# EAGLE schematic ntpi_adapter_v1_led (EAGLE 6.4)
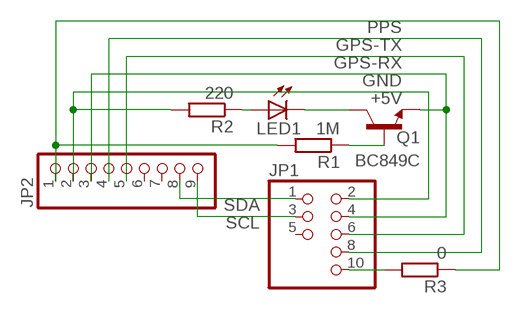
[diagram p0: schematic, sheet 1]

## Parts
JP1  PINHEAD-NTPI  [PINHEAD-NTPI]
JP2  PINHD-1X9  [1X09]
LED1  LEDCHIPLED_0805  [CHIPLED_0805]
Q1  BC849C  BC848ASMD  [SOT23]
R1  1M  R-EU_R0805W  [R0805W]
R2  220  R-EU_R0805W  [R0805W]
R3  0  R-EU_R0805W  [R0805W]

## Nets
+5V: JP1.2 JP2.2 R2.2
GND: JP1.4 JP2.3 Q1.2(E)
GPS-RX: JP1.6 JP2.5
GPS-TX: JP1.8 JP2.4
N$1: JP1.10 R3.2
N$2: LED1.A R2.1
N$3: LED1.C Q1.3(C)
N$4: Q1.1(B) R1.1
PPS: JP2.1 R1.2 R3.1
SCL: JP1.3 JP2.9
SDA: JP1.1 JP2.8
Unconnected: JP1.5 JP2.6 JP2.7

## Library data of the parts
JP1 = frell2:PINHEAD-NTPI
JP2 = pinhead:PINHD-1X9: PIN HEADER
LED1 = led:LED: LED OSRAM: - CHIPLED LG R971, LG N971, LY N971, LG Q971, LY Q971, LO R971, LY R971 LH N974, LH R974 LS Q976, LO Q976, LY Q976 LO Q996 - Hyper CHIPLED LW Q18S LB Q993, LB Q99A, LB R99A - SideLED LS A670, LO A670, LY A670, LG A670, LP A670 LB A673, LV A673, LT A673, LW A673 LH A674 LY A675 LS A676, LA A676, LO A676, LY A676, LW A676 LS A679, LY A679, LG A679 - Hyper Micro SIDELED® LS Y876, LA Y876, LO Y876, LY Y876 LT Y87S - SmartLED LW L88C, LW L88S LB L89C, LB L89S, LG L890 LS L89K, LO L89K, LY L89K LS L896, LA L896, LO L896, LY L896 - TOPLED LS T670, LO T670, LY T670, LG T670, LP T670 LSG T670, LSP T670, LSY T670, LOP T670, LYG T670 LG T671, LOG T671, LSG T671 LB T673, LV T673, LT T673, LW T673 LH T674 LS T676, LA T676, LO T676, LY T676, LB T676, LH T676, LSB T676, LW T676 LB T67C, LV T67C, LT T67C, LS T67K, LO T67K, LY T67K, LW E67C LS E67B, LA E67B, LO E67B, LY E67B, LB E67C, LV E67C, LT E67C LW T67C LS T679, LY T679, LG T679 LS T770, LO T770, LY T770, LG T770, LP T770 LB T773, LV T773, LT T773, LW T773 LH T774 LS E675, LA E675, LY E675, LS T675 LS T776, LA T776, LO T776, LY T776, LB T776 LHGB T686 LT T68C, LB T68C - Hyper Mini TOPLED® LB M676 - Mini TOPLED Santana® LG M470 LS M47K, LO M47K, LY M47K Source: http://www.osram.convergy.de LUXEON: - LUMILED® LXK2-PW12-R00, LXK2-PW12-S00, LXK2-PW14-U00, LXK2-PW14-V00 LXK2-PM12-R00, LXK2-PM12-S00, LXK2-PM14-U00 LXK2-PE12-Q00, LXK2-PE12-R00, LXK2-PE12-S00, LXK2-PE14-T00, LXK2-PE14-U00 LXK2-PB12-K00, LXK2-PB12-L00, LXK2-PB12-M00, LXK2-PB14-N00, LXK2-PB14-P00, LXK2-PB14-Q00 LXK2-PR12-L00, LXK2-PR12-M00, LXK2-PR14-Q00, LXK2-PR14-R00 LXK2-PD12-Q00, LXK2-PD12-R00, LXK2-PD12-S00 LXK2-PH12-R00, LXK2-PH12-S00 LXK2-PL12-P00, LXK2-PL12-Q00, LXK2-PL12-R00 Source: www.luxeon.com KINGBRIGHT: KA-3528ASYC Source: www.kingbright.com
Q1 = transistor-npn:BC848*: NPN Transistor
R1-R3 = resistor:R-EU_: RESISTOR, European symbol